# Altium schematic sheet memory.SchDoc
size A4; SheetNumber: 3; SheetTotal: 6
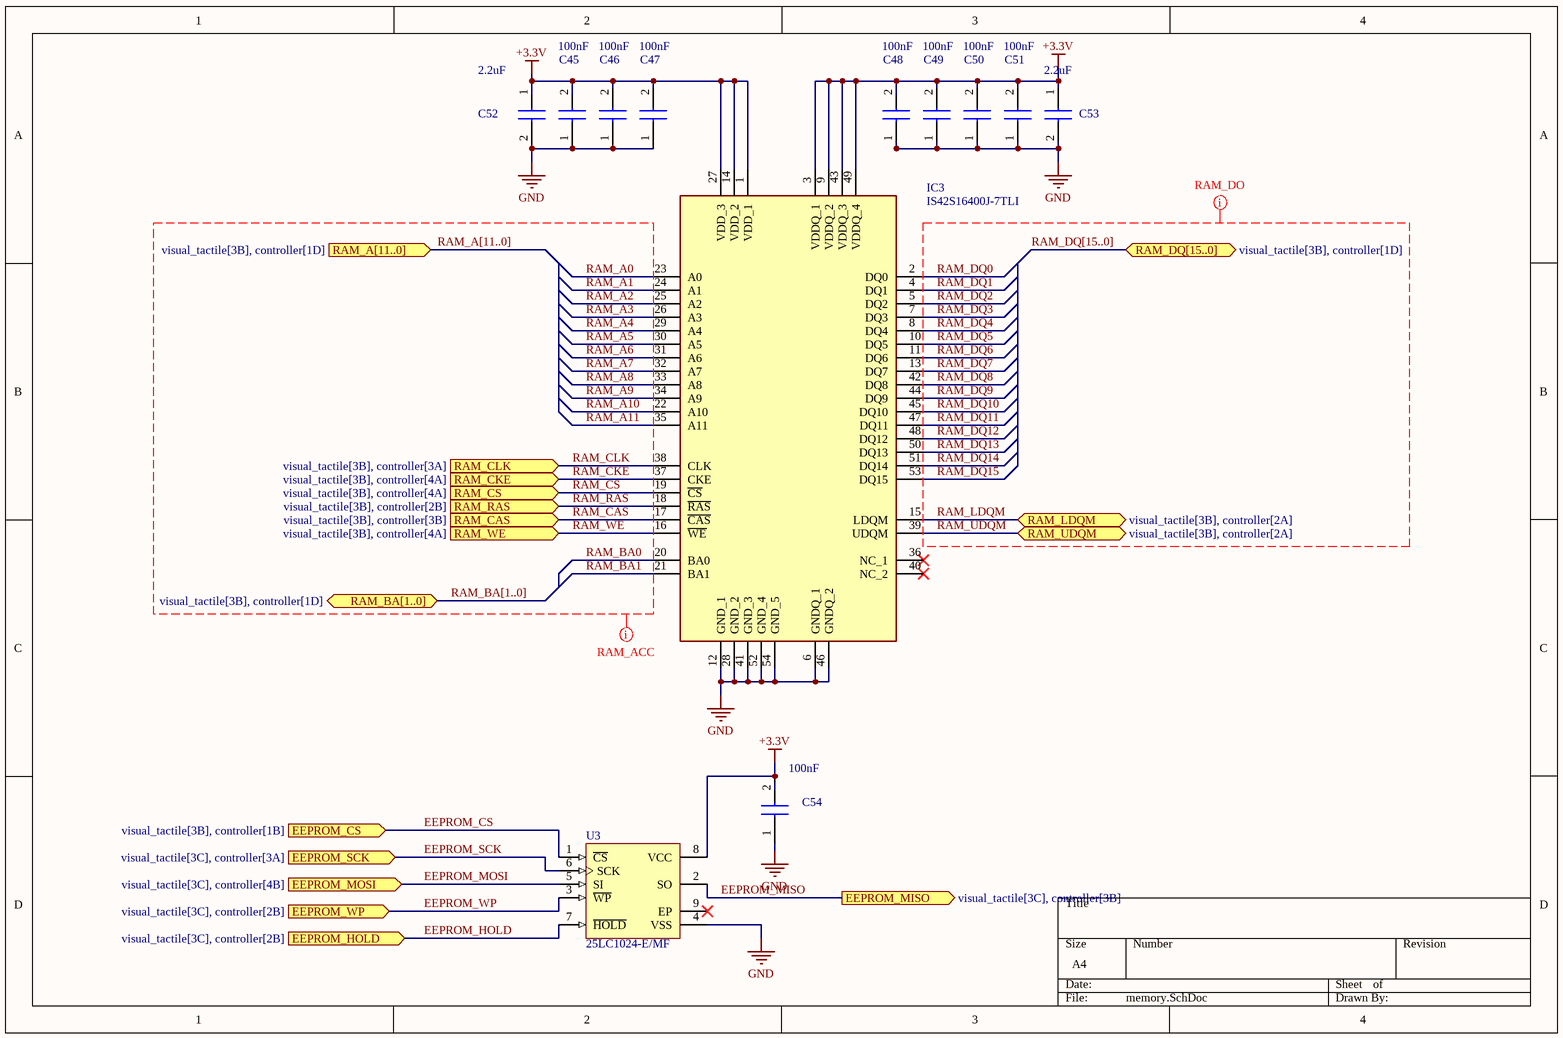
[diagram p0: memory.SchDoc]

## Parts
C45  value 100nF  [CAPC1608X87N]  (hidden comment: CGA3E2X7R1H104K080AA)
C46  value 100nF  [CAPC1608X87N]  (hidden comment: CGA3E2X7R1H104K080AA)
C47  value 100nF  [CAPC1608X87N]  (hidden comment: CGA3E2X7R1H104K080AA)
C48  value 100nF  [CAPC1608X87N]  (hidden comment: CGA3E2X7R1H104K080AA)
C49  value 100nF  [CAPC1608X87N]  (hidden comment: CGA3E2X7R1H104K080AA)
C50  value 100nF  [CAPC1608X87N]  (hidden comment: CGA3E2X7R1H104K080AA)
C51  value 100nF  [CAPC1608X87N]  (hidden comment: CGA3E2X7R1H104K080AA)
C52  value 2.2uF  [CAPC1608X87N]  (hidden comment: 06036C225KAT2A)
C53  value 2.2uF  [CAPC1608X87N]  (hidden comment: 06036C225KAT2A)
C54  value 100nF  [CAPC1608X87N]  (hidden comment: CGA3E2X7R1H104K080AA)
IC3  IS42S16400J-7TLI  [SOP80P1176X120-54N]
U3  25LC1024-E/MF  [DFNS-MF8]

## Ports
EEPROM_CS (in, see visual_tactile[3B], controller[1B]), EEPROM_HOLD (in, see visual_tactile[3C], controller[2B]), EEPROM_MISO (out, see visual_tactile[3C], controller[3B]), EEPROM_MOSI (in, see visual_tactile[3C], controller[4B]), EEPROM_SCK (in, see visual_tactile[3C], controller[3A]), EEPROM_WP (in, see visual_tactile[3C], controller[2B]), RAM_A[11..0] (in, see visual_tactile[3B], controller[1D]), RAM_BA[1..0] (bidir, see visual_tactile[3B], controller[1D]), RAM_CAS (in, see visual_tactile[3B], controller[3B]), RAM_CKE (in, see visual_tactile[3B], controller[4A]), RAM_CLK (in, see visual_tactile[3B], controller[3A]), RAM_CS (in, see visual_tactile[3B], controller[4A]), RAM_DQ[15..0] (bidir, see visual_tactile[3B], controller[1D]), RAM_LDQM (bidir, see visual_tactile[3B], controller[2A]), RAM_RAS (in, see visual_tactile[3B], controller[2B]), RAM_UDQM (bidir, see visual_tactile[3B], controller[2A]), RAM_WE (in, see visual_tactile[3B], controller[4A])

## Nets
+3.3V: C45.2 C46.2 C47.2 C48.2 C49.2 C50.2 C51.2 C52.1 C53.1 C54.2 IC3.1(VDD_1) IC3.3(VDDQ_1) IC3.9(VDDQ_2) IC3.14(VDD_2) IC3.27(VDD_3) IC3.43(VDDQ_3) IC3.49(VDDQ_4) U3.8(VCC)
GND: C45.1 C46.1 C47.1 C48.1 C49.1 C50.1 C51.1 C52.2 C53.2 C54.1 IC3.6(GNDQ_1) IC3.12(GND_1) IC3.28(GND_2) IC3.41(GND_3) IC3.46(GNDQ_2) IC3.52(GND_4) IC3.54(GND_5) U3.4(VSS)
EEPROM_CS: U3.1(~{CS}) ; port EEPROM_CS
EEPROM_HOLD: U3.7(~{HOLD}) ; port EEPROM_HOLD
EEPROM_MISO: U3.2(SO) ; port EEPROM_MISO
EEPROM_MOSI: U3.5(SI) ; port EEPROM_MOSI
EEPROM_SCK: U3.6(SCK) ; port EEPROM_SCK
EEPROM_WP: U3.3(~{WP}) ; port EEPROM_WP
RAM_A0: IC3.23(A0)
RAM_A1: IC3.24(A1)
RAM_A2: IC3.25(A2)
RAM_A3: IC3.26(A3)
RAM_A4: IC3.29(A4)
RAM_A5: IC3.30(A5)
RAM_A6: IC3.31(A6)
RAM_A7: IC3.32(A7)
RAM_A8: IC3.33(A8)
RAM_A9: IC3.34(A9)
RAM_A10: IC3.22(A10)
RAM_A11: IC3.35(A11)
RAM_BA0: IC3.20(BA0)
RAM_BA1: IC3.21(BA1)
RAM_CAS: IC3.17(~{CAS}) ; port RAM_CAS
RAM_CKE: IC3.37(CKE) ; port RAM_CKE
RAM_CLK: IC3.38(CLK) ; port RAM_CLK
RAM_CS: IC3.19(~{CS}) ; port RAM_CS
RAM_DQ0: IC3.2(DQ0)
RAM_DQ1: IC3.4(DQ1)
RAM_DQ2: IC3.5(DQ2)
RAM_DQ3: IC3.7(DQ3)
RAM_DQ4: IC3.8(DQ4)
RAM_DQ5: IC3.10(DQ5)
RAM_DQ6: IC3.11(DQ6)
RAM_DQ7: IC3.13(DQ7)
RAM_DQ8: IC3.42(DQ8)
RAM_DQ9: IC3.44(DQ9)
RAM_DQ10: IC3.45(DQ10)
RAM_DQ11: IC3.47(DQ11)
RAM_DQ12: IC3.48(DQ12)
RAM_DQ13: IC3.50(DQ13)
RAM_DQ14: IC3.51(DQ14)
RAM_DQ15: IC3.53(DQ15)
RAM_LDQM: IC3.15(LDQM) ; port RAM_LDQM
RAM_RAS: IC3.18(~{RAS}) ; port RAM_RAS
RAM_UDQM: IC3.39(UDQM) ; port RAM_UDQM
RAM_WE: IC3.16(~{WE}) ; port RAM_WE

Not connected (* = marked no-connect by the designer): IC3 36(NC_1)* 40(NC_2)*; U3 9(EP)*

## Buses and harness runs
bus RAM_A[11..0] = port RAM_A[11..0]
bus RAM_BA[1..0] = port RAM_BA[1..0]
bus RAM_DQ[15..0] = port RAM_DQ[15..0]

## Layout directives
net class RAM_ACC; rule Matched Net Lengths [Delay Tolerance = 100ps]: RAM_A0, RAM_A1, RAM_A2, RAM_A3, RAM_A4, RAM_A5, RAM_A6, RAM_A7, RAM_A8, RAM_A9, RAM_A10, RAM_A11, RAM_A[11..0], RAM_BA0, RAM_BA1, RAM_BA[1..0], RAM_CAS, RAM_CKE, RAM_CLK, RAM_CS, RAM_RAS, RAM_WE
net class RAM_D; rule Matched Net Lengths [Delay Tolerance = 100ps]: RAM_DQ0, RAM_DQ1, RAM_DQ2, RAM_DQ3, RAM_DQ4, RAM_DQ5, RAM_DQ6, RAM_DQ7, RAM_DQ8, RAM_DQ9, RAM_DQ10, RAM_DQ11, RAM_DQ12, RAM_DQ13, RAM_DQ14, RAM_DQ15, RAM_DQ[15..0], RAM_LDQM, RAM_UDQM

## Library data of the parts
C45-C51 C54 = C0603C300J5GACTU: Ceramic Capacitor, Multilayer, Ceramic, 50V, 10% +Tol, 10% -Tol, X7R, 15% TC, 0.1uF, Surface Mount, 0603; Manufacturer_Name: KEMET; Manufacturer: TDK; Multilayer: Yes; Reference Standard: AEC-Q200; Datasheet Link: https://content.kemet.com/datasheets/KEM_C1003_C0G_SMD.pdf; Height: 0.87mm; Manufacturer_Part_Number: C0603C300J5GACTU; Mouser Part Number: 80-C0603C300J5G; Mouser Price/Stock: https://www.mouser.co.uk/ProductDetail/KEMET/C0603C300J5GACTU?qs=KQYYlyH3z3RpeXhtJmCcMA%3D%3D; Arrow Part Number: C0603C300J5GACTU; Arrow Price/Stock: https://www.arrow.com/en/products/c0603c300j5gactu/kemet-corporation; Supplier: Rs; Supplier Part Number: 7882985P; Manufacturer Part Number: CGA3E2X7R1H104K080AA; RoHS: Yes; Category: Ceramic Capacitors; Stock: 84850; Pricing: 250=0.042, 500=0.039, 1000=0.037, 2500=0.033 (EUR); Mounting Technology: Surface Mount; Pins: 2; Dielectric Material: Ceramic; Package Shape: Rectangular; Case/Package: 0603; Terminal Finish: Nickel; Min Operating Temperature: -55°C; Max Operating Temperature: 125°C; JESD-609 Code: e3; Capacitor Type: Ceramic; Tolerance  (fill in as +-): 10%; Package Style: SMTMeter; Packaging: Tape and Reel; Tolerance (fill in as +-): 10%; Rated DC Voltage (URdc): 50V; Temperature Characteristics Code: X7R; Termination: Wraparound; Length: 1.6mm; Width: 0.8mm; Reach SVHC Compliant: Yes; RoHS Compliant: Yes; ComponentLink1URL: https://datasheet.ciiva.com:443/pdfs/VipMasterIC/IC/TDKC/TDKC-S-A0008953915/TDKC-S-A0008953915-1.pdf?src-supplier=IHS+Markit; ComponentLink1Description: https://datasheet.ciiva.com:443/pdfs/VipMasterIC/IC/TDKC/TDKC-S-A0008953915/TDKC-S-A0008953915-1.pdf?src-supplier=IHS+Markit
C52 C53 = C0603C300J5GACTU: Ceramic Capacitor, Multilayer, Ceramic, 6.3V, 10% +Tol, 10% -Tol, X7R, 15% TC, 2.2uF, Surface Mount, 0603; Manufacturer_Name: KEMET; Manufacturer Part Number: C0603C225K4PACTU; Description: Ceramic Capacitor, Multilayer, Ceramic, 16V, 10% +Tol, 10% -Tol, X5R, 15% TC, 2.2uF, Surface Mount, 0603; Multilayer: Yes; Rated DC Voltage (URdc): 16V; Temperature Characteristics Code: X5R; Datasheet Link: https://content.kemet.com/datasheets/KEM_C1003_C0G_SMD.pdf; Height: 0.87mm; Manufacturer_Part_Number: C0603C300J5GACTU; Mouser Part Number: 80-C0603C300J5G; Mouser Price/Stock: https://www.mouser.co.uk/ProductDetail/KEMET/C0603C300J5GACTU?qs=KQYYlyH3z3RpeXhtJmCcMA%3D%3D; Arrow Part Number: C0603C300J5GACTU; Arrow Price/Stock: https://www.arrow.com/en/products/c0603c300j5gactu/kemet-corporation; Supplier: Mouser; Supplier Part Number: 80-C0603C225K4P; Manufacturer: KEMET; RoHS: Yes; Category: Ceramic Capacitors; Stock: 124128; Pricing: 1=0.12, 10=0.049, 50=0.049, 100=0.029, 1000=0.024, 10000=0.022 (USD); Mounting Technology: Surface Mount; Pins: 2; Dielectric Material: Ceramic; Package Shape: Rectangular; Case/Package: 0603; Terminal Finish: Nickel; Min Operating Temperature: -55°C; Max Operating Temperature: 85°C; JESD-609 Code: e3; Capacitor Type: Ceramic; Tolerance  (fill in as +-): 10%; Package Style: SMTMeter; Packaging: Tape and Reel; Tolerance (fill in as +-): 10%; Termination: Wraparound; Length: 1.6mm; Width: 0.8mm; Reach SVHC Compliant: Yes; RoHS Compliant: Yes; ComponentLink1URL: https://datasheet.ciiva.com:443/pdfs/VipMasterIC/IC/KEME/KEME-S-A0008991665/KEME-S-A0008991665-1.pdf?src-supplier=IHS+Markit; ComponentLink1Description: https://datasheet.ciiva.com:443/pdfs/VipMasterIC/IC/KEME/KEME-S-A0008991665/KEME-S-A0008991665-1.pdf?src-supplier=IHS+Markit; ComponentLink2URL: https://datasheet.ciiva.com:443/pdfs/VipMasterIC/IC/AVXC/AVXC-S-A0009640452/AVXC-S-A0009640452-1.pdf?src-supplier=IHS+Markit; ComponentLink2Description: https://datasheet.ciiva.com:443/pdfs/VipMasterIC/IC/AVXC/AVXC-S-A0009640452/AVXC-S-A0009640452-1.pdf?src-supplier=IHS+Markit
IC3 = IS42S16400J-7TLI: Integrated Circuit; Manufacturer_Name: Integrated Silicon Solution Inc.; Datasheet Link: http://www.issi.com/WW/pdf/42-45S16400J.pdf; Height: 1.2mm; Manufacturer_Part_Number: IS42S16400J-7TLI; Mouser Part Number: 870-IS42S16400J-7TLI; Mouser Price/Stock: https://www.mouser.co.uk/ProductDetail/ISSI/IS42S16400J-7TLI?qs=eOmjsnl%2FhF6IYGbICFWNhg%3D%3D; Arrow Part Number: IS42S16400J-7TLI; Arrow Price/Stock: https://www.arrow.com/en/products/is42s16400j-7tli/integrated-silicon-solution-inc?region=europe
U3 = CMP-0165-00187-2: 1 Mbit SPI Bus Serial EEPROM, 8-Pin DFN, Extended Temperature; PackageVersion: revBB, Aug-2009; PackageDescription: 8-Lead Plastic Dual Flat, No Lead Package (MF) - 6x5 mm Body [DFN-S]; PackageReference: DFNS-MF8; DatasheetVersion: revC, Oct-2008